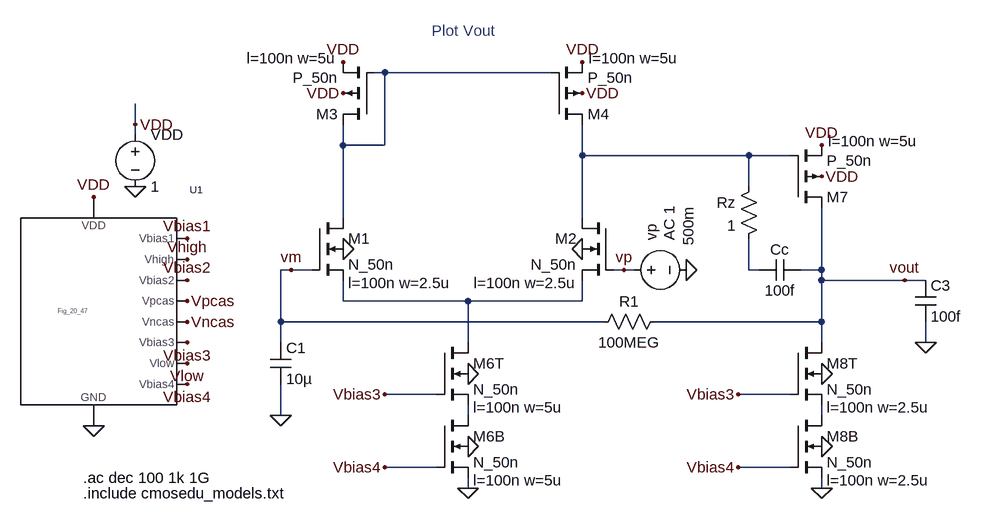
[diagram p0: schematic Fig24_10.asc]
Fig24_10.asc, the LTspice schematic file:
Version 4
SHEET 1 2144 680
WIRE 1248 -432 1232 -432
WIRE 1504 -432 1248 -432
WIRE 864 -352 864 -384
WIRE 864 -336 864 -352
WIRE 1184 -320 1184 -352
WIRE 1248 -320 1248 -432
WIRE 1248 -320 1184 -320
WIRE 1552 -304 1552 -352
WIRE 1808 -304 1552 -304
WIRE 1872 -304 1808 -304
WIRE 1808 -256 1808 -304
WIRE 1184 -208 1184 -320
WIRE 1552 -208 1552 -304
WIRE 1104 -128 1088 -128
WIRE 1136 -128 1104 -128
WIRE 1616 -128 1600 -128
WIRE 1632 -128 1616 -128
WIRE 1808 -128 1808 -176
WIRE 1824 -128 1808 -128
WIRE 1920 -128 1920 -224
WIRE 1920 -128 1888 -128
WIRE 1920 -112 1920 -128
WIRE 2048 -112 1920 -112
WIRE 2080 -112 2048 -112
WIRE 1184 -80 1184 -112
WIRE 1376 -80 1184 -80
WIRE 1552 -80 1552 -112
WIRE 1552 -80 1376 -80
WIRE 1088 -48 1088 -128
WIRE 1584 -48 1088 -48
WIRE 1920 -48 1920 -112
WIRE 1920 -48 1664 -48
WIRE 1088 -16 1088 -48
WIRE 1376 -16 1376 -80
WIRE 1920 -16 1920 -48
WIRE 2080 -16 2080 -48
WIRE 1328 64 1248 64
WIRE 1872 64 1792 64
WIRE 1088 96 1088 48
WIRE 1376 96 1376 80
WIRE 1920 96 1920 80
WIRE 1328 176 1248 176
WIRE 1872 176 1792 176
WIRE 1376 208 1376 192
WIRE 1920 208 1920 192
FLAG 864 -256 0
FLAG 864 -352 VDD
FLAG 1552 -160 0
FLAG 1376 208 0
FLAG 1184 -160 0
FLAG 1552 -448 VDD
FLAG 1552 -400 VDD
FLAG 1184 -400 VDD
FLAG 800 -240 VDD
FLAG 800 112 0
FLAG 944 -176 Vbias1
FLAG 944 -144 Vhigh
FLAG 944 -112 Vbias2
FLAG 944 -16 Vbias3
FLAG 944 -80 Vpcas
FLAG 944 -48 Vncas
FLAG 944 48 Vbias4
FLAG 944 16 Vlow
FLAG 1184 -448 VDD
FLAG 1376 32 0
FLAG 1376 144 0
FLAG 1248 64 Vbias3
FLAG 1248 176 Vbias4
FLAG 1712 -128 0
FLAG 1104 -128 vm
FLAG 1616 -128 vp
FLAG 1920 -320 VDD
FLAG 1920 -272 VDD
FLAG 1920 208 0
FLAG 1920 32 0
FLAG 1920 144 0
FLAG 1792 64 Vbias3
FLAG 1792 176 Vbias4
FLAG 2048 -112 vout
FLAG 1088 96 0
FLAG 2080 -16 0
SYMBOL voltage 864 -352 R0
WINDOW 123 0 0 Left 2
WINDOW 39 0 0 Left 2
SYMATTR InstName VDD
SYMATTR Value 1
SYMBOL nmos4 1600 -208 M0
WINDOW 123 56 100 Left 2
SYMATTR Value2 l=100n w=2.5u
SYMATTR InstName M2
SYMATTR Value N_50n
SYMBOL nmos4 1136 -208 R0
WINDOW 123 56 100 Left 2
SYMATTR Value2 l=100n w=2.5u
SYMATTR InstName M1
SYMATTR Value N_50n
SYMBOL pmos4 1504 -352 M180
WINDOW 123 58 102 Left 2
WINDOW 0 56 16 Left 2
SYMATTR Value2 l=100n w=5u
SYMATTR InstName M4
SYMATTR Value P_50n
SYMBOL pmos4 1232 -352 R180
WINDOW 123 58 102 Left 2
WINDOW 0 56 16 Left 2
SYMATTR Value2 l=100n w=5u
SYMATTR InstName M3
SYMATTR Value P_50n
SYMBOL Fig_20_47 800 -64 R0
SYMATTR InstName U1
SYMBOL nmos4 1328 -16 R0
WINDOW 123 56 100 Left 2
SYMATTR Value2 l=100n w=5u
SYMATTR InstName M6T
SYMATTR Value N_50n
SYMBOL nmos4 1328 96 R0
WINDOW 123 56 100 Left 2
SYMATTR Value2 l=100n w=5u
SYMATTR InstName M6B
SYMATTR Value N_50n
SYMBOL voltage 1616 -128 R270
WINDOW 0 45 42 Left 2
WINDOW 3 37 99 Left 2
WINDOW 123 45 70 Left 2
WINDOW 39 0 0 Left 2
SYMATTR InstName vp
SYMATTR Value 500m
SYMATTR Value2 AC 1
SYMBOL pmos4 1872 -224 M180
WINDOW 123 58 102 Left 2
WINDOW 0 56 16 Left 2
SYMATTR Value2 l=100n w=5u
SYMATTR InstName M7
SYMATTR Value P_50n
SYMBOL nmos4 1872 -16 R0
WINDOW 123 56 100 Left 2
SYMATTR Value2 l=100n w=2.5u
SYMATTR InstName M8T
SYMATTR Value N_50n
SYMBOL nmos4 1872 96 R0
WINDOW 123 56 100 Left 2
SYMATTR Value2 l=100n w=2.5u
SYMATTR InstName M8B
SYMATTR Value N_50n
SYMBOL cap 1072 -16 R0
SYMATTR InstName C1
SYMATTR Value 10µ
SYMBOL res 1568 -32 R270
WINDOW 0 32 56 VTop 2
WINDOW 3 0 56 VBottom 2
SYMATTR InstName R1
SYMATTR Value 100MEG
SYMBOL cap 1888 -144 R90
WINDOW 0 0 32 VBottom 2
WINDOW 3 32 32 VTop 2
SYMATTR InstName Cc
SYMATTR Value 100f
SYMBOL cap 2064 -112 R0
SYMATTR InstName C3
SYMATTR Value 100f
SYMBOL res 1824 -272 M0
SYMATTR InstName Rz
SYMATTR Value 1
TEXT 784 216 Left 2 !.include cmosedu_models.txt
TEXT 1320 -496 Left 2 ;Plot Vout
TEXT 784 192 Left 2 !.ac dec 100 1k 1G

The netlist it stands for:
* Fig24_10.asc
VDD VDD 0 1
M2 N002 vp N004 0 N_50n l=100n w=2.5u
M1 N001 vm N004 0 N_50n l=100n w=2.5u
M4 N002 N001 VDD VDD P_50n l=100n w=5u
M3 N001 N001 VDD VDD P_50n l=100n w=5u
XU1 Vbias1 Vhigh Vbias2 Vpcas Vncas Vbias3 Vlow Vbias4 VDD 0 Fig_20_47  ; pins Vbias1 Vhigh Vbias2 Vpcas Vncas Vbias3 Vlow Vbias4 VDD GND
M6T N004 Vbias3 N005 0 N_50n l=100n w=5u
M6B N005 Vbias4 0 0 N_50n l=100n w=5u
vp vp 0 500m AC 1
M7 vout N002 VDD VDD P_50n l=100n w=5u
M8T vout Vbias3 N006 0 N_50n l=100n w=2.5u
M8B N006 Vbias4 0 0 N_50n l=100n w=2.5u
C1 vm 0 10µ
R1 vm vout 100MEG
Cc vout N003 100f
C3 vout 0 100f
Rz N002 N003 1
.model NMOS NMOS
.model PMOS PMOS
.lib standard.mos
.include cmosedu_models.txt
* Plot Vout
.ac dec 100 1k 1G
.backanno
.end